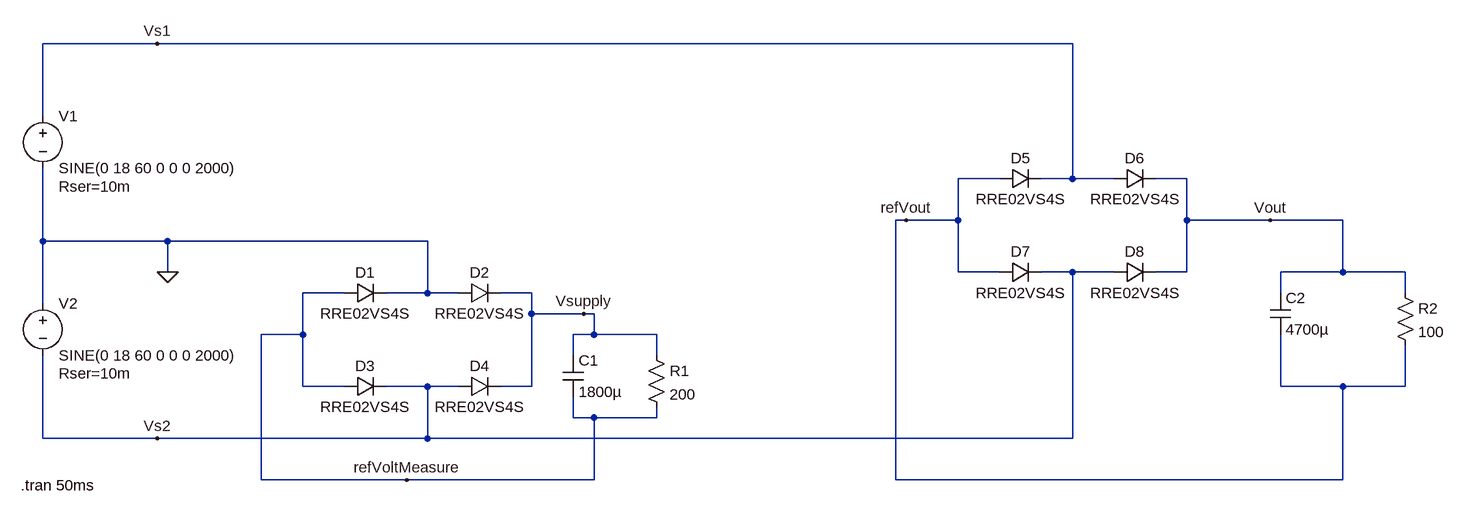
[diagram p0: schematic TwoBridgeProblem.asc]
TwoBridgeProblem.asc, the LTspice schematic file:
Version 4
SHEET 1 2180 1340
WIRE 192 -144 16 -144
WIRE 1600 -144 192 -144
WIRE 16 -32 16 -144
WIRE 1488 64 1424 64
WIRE 1600 64 1600 -144
WIRE 1600 64 1552 64
WIRE 1664 64 1600 64
WIRE 1776 64 1728 64
WIRE 1344 128 1328 128
WIRE 1424 128 1424 64
WIRE 1424 128 1344 128
WIRE 1776 128 1776 64
WIRE 1904 128 1776 128
WIRE 2016 128 1904 128
WIRE 16 160 16 48
WIRE 208 160 16 160
WIRE 608 160 208 160
WIRE 208 208 208 160
WIRE 1424 208 1424 128
WIRE 1488 208 1424 208
WIRE 1600 208 1552 208
WIRE 1664 208 1600 208
WIRE 1776 208 1776 128
WIRE 1776 208 1728 208
WIRE 2016 208 2016 128
WIRE 2016 208 1920 208
WIRE 2112 208 2016 208
WIRE 480 240 416 240
WIRE 608 240 608 160
WIRE 608 240 544 240
WIRE 656 240 608 240
WIRE 768 240 720 240
WIRE 1920 240 1920 208
WIRE 2112 240 2112 208
WIRE 16 256 16 160
WIRE 768 272 768 240
WIRE 848 272 768 272
WIRE 864 272 848 272
WIRE 416 304 416 240
WIRE 416 304 352 304
WIRE 864 304 864 272
WIRE 864 304 832 304
WIRE 960 304 864 304
WIRE 832 336 832 304
WIRE 960 336 960 304
WIRE 416 384 416 304
WIRE 480 384 416 384
WIRE 608 384 544 384
WIRE 656 384 608 384
WIRE 768 384 768 272
WIRE 768 384 720 384
WIRE 1920 384 1920 304
WIRE 2016 384 1920 384
WIRE 2112 384 2112 320
WIRE 2112 384 2016 384
WIRE 832 432 832 400
WIRE 864 432 832 432
WIRE 960 432 960 416
WIRE 960 432 864 432
WIRE 16 464 16 336
WIRE 192 464 16 464
WIRE 608 464 608 384
WIRE 608 464 192 464
WIRE 1600 464 1600 208
WIRE 1600 464 608 464
WIRE 352 528 352 304
WIRE 576 528 352 528
WIRE 864 528 864 432
WIRE 864 528 576 528
WIRE 1328 528 1328 128
WIRE 2016 528 2016 384
WIRE 2016 528 1328 528
FLAG 192 -144 Vs1
FLAG 192 464 Vs2
FLAG 208 208 0
FLAG 1904 128 Vout
FLAG 1344 128 refVout
FLAG 848 272 Vsupply
FLAG 576 528 refVoltMeasure
SYMBOL voltage 16 240 R0
WINDOW 123 0 0 Left 0
WINDOW 39 24 124 Left 2
SYMATTR InstName V2
SYMATTR Value SINE(0 18 60 0 0 0 2000)
SYMATTR SpiceLine Rser=10m
SYMBOL voltage 16 -48 R0
WINDOW 123 0 0 Left 0
WINDOW 39 24 124 Left 2
SYMATTR InstName V1
SYMATTR Value SINE(0 18 60 0 0 0 2000)
SYMATTR SpiceLine Rser=10m
SYMBOL diode 480 256 R270
WINDOW 0 32 32 VTop 2
WINDOW 3 0 32 VBottom 2
SYMATTR InstName D1
SYMATTR Value RRE02VS4S
SYMBOL diode 656 256 R270
WINDOW 0 32 32 VTop 2
WINDOW 3 0 32 VBottom 2
SYMATTR InstName D2
SYMATTR Value RRE02VS4S
SYMBOL diode 480 400 R270
WINDOW 0 32 32 VTop 2
WINDOW 3 0 32 VBottom 2
SYMATTR InstName D3
SYMATTR Value RRE02VS4S
SYMBOL diode 656 400 R270
WINDOW 0 32 32 VTop 2
WINDOW 3 0 32 VBottom 2
SYMATTR InstName D4
SYMATTR Value RRE02VS4S
SYMBOL diode 1488 80 R270
WINDOW 0 32 32 VTop 2
WINDOW 3 0 32 VBottom 2
SYMATTR InstName D5
SYMATTR Value RRE02VS4S
SYMBOL diode 1664 80 R270
WINDOW 0 32 32 VTop 2
WINDOW 3 0 32 VBottom 2
SYMATTR InstName D6
SYMATTR Value RRE02VS4S
SYMBOL diode 1488 224 R270
WINDOW 0 32 32 VTop 2
WINDOW 3 0 32 VBottom 2
SYMATTR InstName D7
SYMATTR Value RRE02VS4S
SYMBOL diode 1664 224 R270
WINDOW 0 32 32 VTop 2
WINDOW 3 0 32 VBottom 2
SYMATTR InstName D8
SYMATTR Value RRE02VS4S
SYMBOL cap 816 336 R0
SYMATTR InstName C1
SYMATTR Value 1800µ
SYMBOL res 944 320 R0
SYMATTR InstName R1
SYMATTR Value 200
SYMBOL res 2096 224 R0
SYMATTR InstName R2
SYMATTR Value 100
SYMBOL cap 1904 240 R0
SYMATTR InstName C2
SYMATTR Value 4700µ
TEXT -18 536 Left 2 !.tran 50ms

The netlist it stands for:
* TwoBridgeProblem.asc
V2 0 Vs2 SINE(0 18 60 0 0 0 2000) Rser=10m
V1 Vs1 0 SINE(0 18 60 0 0 0 2000) Rser=10m
D1 refVoltMeasure 0 RRE02VS4S
D2 0 Vsupply RRE02VS4S
D3 refVoltMeasure Vs2 RRE02VS4S
D4 Vs2 Vsupply RRE02VS4S
D5 refVout Vs1 RRE02VS4S
D6 Vs1 Vout RRE02VS4S
D7 refVout Vs2 RRE02VS4S
D8 Vs2 Vout RRE02VS4S
C1 Vsupply refVoltMeasure 1800µ
R1 Vsupply refVoltMeasure 200
R2 Vout refVout 100
C2 Vout refVout 4700µ
.model D D
.lib standard.dio
.tran 50ms
.backanno
.end